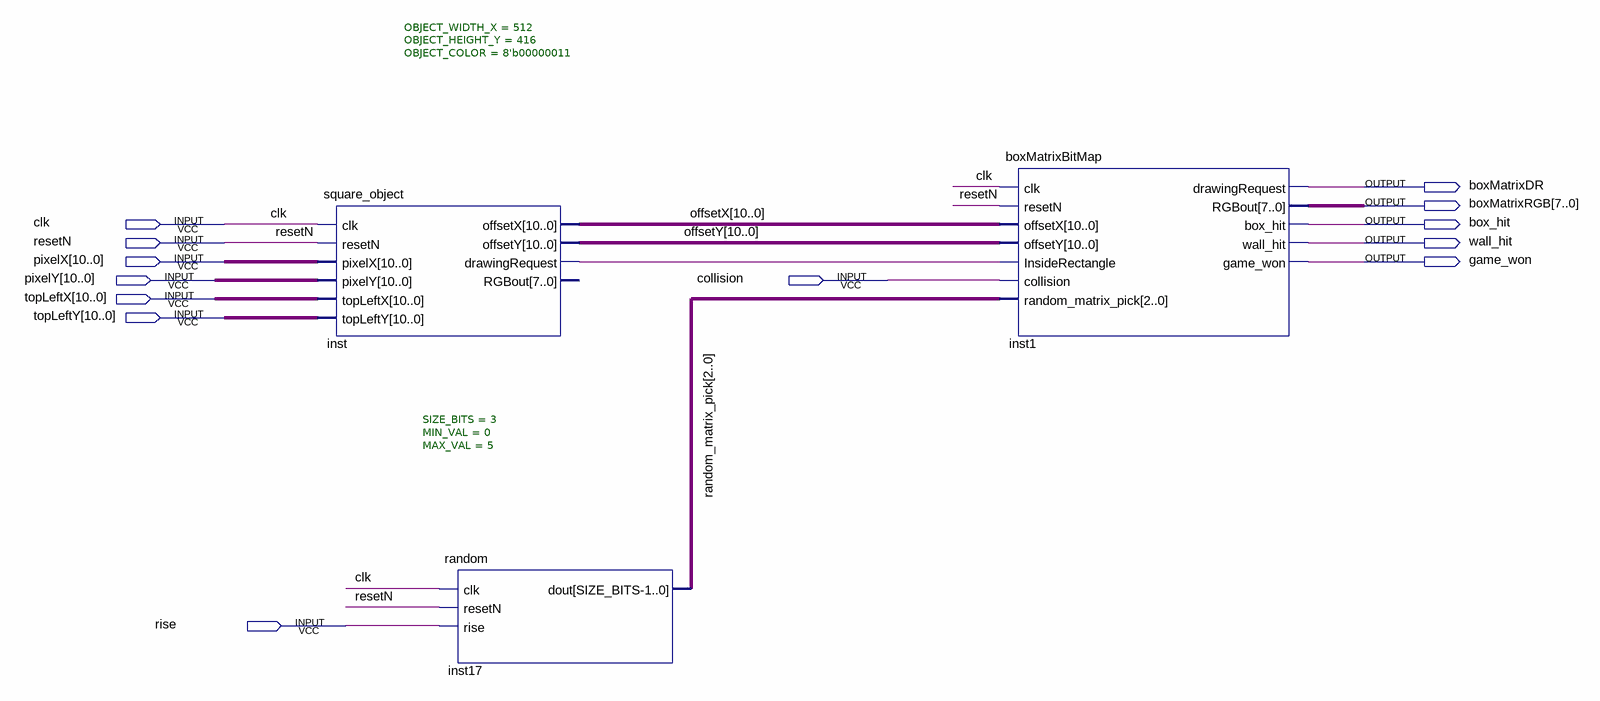
[diagram p0: schematic sheet]
// Quartus schematic BOX_DISPLAY.bdf as structural Verilog: 3 symbols, 13 pins
module BOX_DISPLAY (
  input  clk,
  input  resetN,
  input  [10:0] pixelX,
  input  [10:0] pixelY,
  input  collision,
  input  [10:0] topLeftX,
  input  [10:0] topLeftY,
  input  rise,
  output boxMatrixDR,
  output [7:0] boxMatrixRGB,
  output box_hit,
  output wall_hit,
  output game_won
);

  wire inst_drawingrequest;
  wire [2:0] random_matrix_pick;
  wire [10:0] offsetX, offsetY;

  square_object #(.OBJECT_WIDTH_X(512), .OBJECT_HEIGHT_Y(416), .OBJECT_COLOR(8'b00000011)) inst (
    .clk(clk), .resetN(resetN), .pixelX(pixelX), .pixelY(pixelY), .topLeftX(topLeftX), .topLeftY(topLeftY),
    .offsetX(offsetX), .offsetY(offsetY), .drawingRequest(inst_drawingrequest));  // open: RGBout
  random #(.SIZE_BITS(3), .MIN_VAL(0), .MAX_VAL(5)) inst17 (
    .clk(clk), .resetN(resetN), .rise(rise), .dout(random_matrix_pick));
  boxMatrixBitMap inst1 (
    .clk(clk), .resetN(resetN), .offsetX(offsetX), .offsetY(offsetY), .InsideRectangle(inst_drawingrequest),
    .collision(collision), .random_matrix_pick(random_matrix_pick), .drawingRequest(boxMatrixDR),
    .RGBout(boxMatrixRGB), .box_hit(box_hit), .wall_hit(wall_hit), .game_won(game_won));
endmodule
